# EAGLE design Exoskeleton_PCB_v2 (EAGLE 9.6.2)
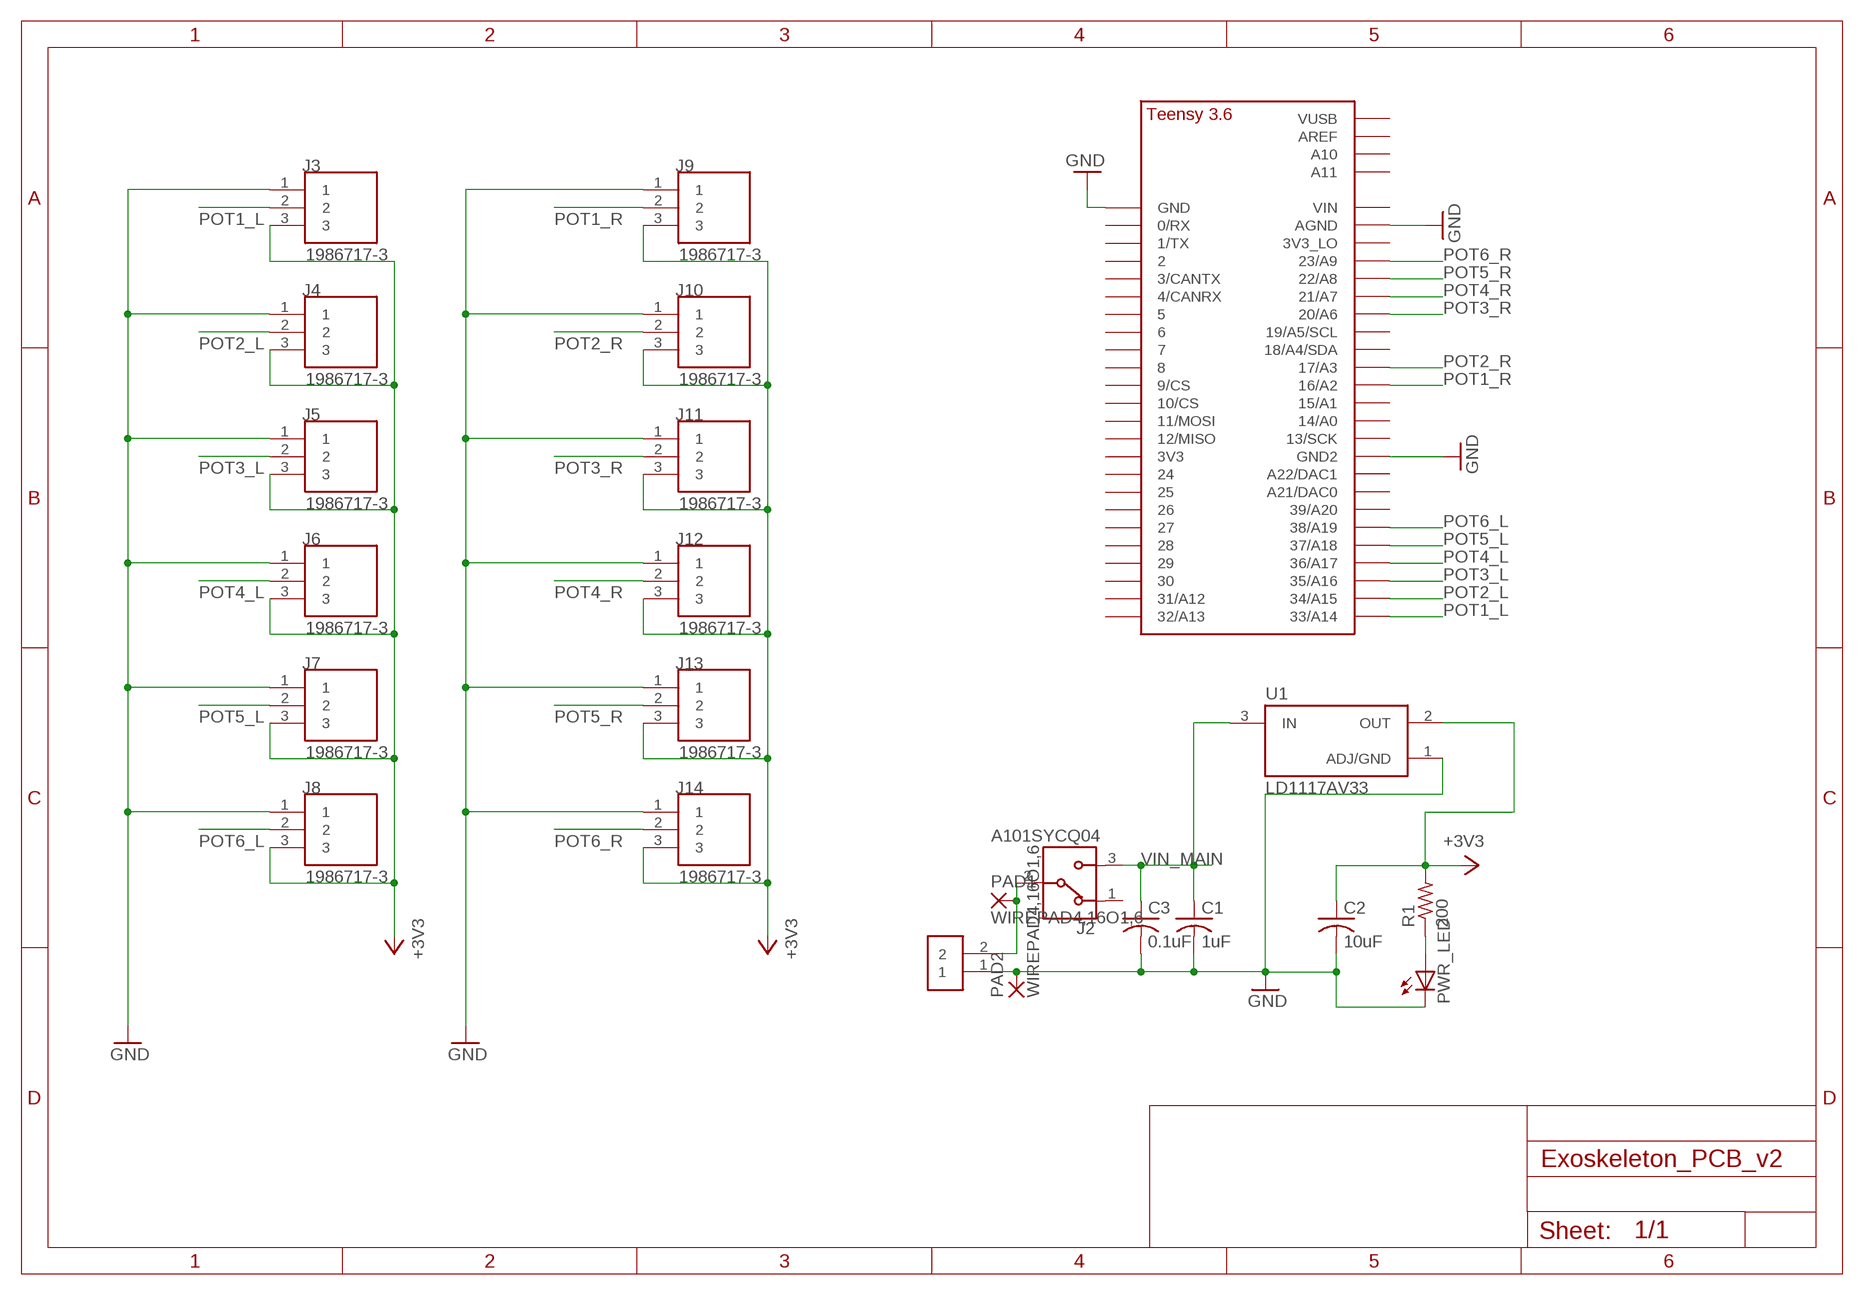
[diagram p0: schematic, sheet 1]

## Parts
C1  1uF  C-US050-030X075  [C050-030X075]
C2  10uF  C-US050-030X075  [C050-030X075]
C3  0.1uF  C-US050-030X075  [C050-030X075]
J1  282837-2  [TE_282837-2]
J2  A101SYCQ04  [TE_A101SYCQ04]
J3  1986717-3  [TE_1986717-3]
J4  1986717-3  [TE_1986717-3]
J5  1986717-3  [TE_1986717-3]
J6  1986717-3  [TE_1986717-3]
J7  1986717-3  [TE_1986717-3]
J8  1986717-3  [TE_1986717-3]
J9  1986717-3  [TE_1986717-3]
J10  1986717-3  [TE_1986717-3]
J11  1986717-3  [TE_1986717-3]
J12  1986717-3  [TE_1986717-3]
J13  1986717-3  [TE_1986717-3]
J14  1986717-3  [TE_1986717-3]
PAD1  WIREPAD4,16O1,6  [4,16O1,6]
PAD2  WIREPAD4,16O1,6  [4,16O1,6]
PWR_LED  LED5MM  [LED5MM]
R1  200  R-US_0207/9  [0207/9]
U1  LD1117AV33  [TO255P1020X450X1968-3]
U$1  TEENSY_3.5/3.6_BASIC  [TEENSY_3.5/3.6_BASIC]

## Nets
+3V3 [PWR]: C2.1 J3.3 J4.3 J5.3 J6.3 J7.3 J8.3 J9.3 J10.3 J11.3 J12.3 J13.3 J14.3 R1.2 U1.2(OUT)
GND: C1.2 C2.2 C3.2 J1.1 J3.1 J4.1 J5.1 J6.1 J7.1 J8.1 J9.1 J10.1 J11.1 J12.1 J13.1 J14.1 PAD2.1(P) PWR_LED.K(C) U1.1(ADJ/GND) U$1.AGND U$1.GND U$1.GND2
N$1: PWR_LED.A R1.1
N$8: J1.2 J2.2 PAD1.1(P)
POT1_L: J3.2 U$1.33/A14
POT1_R: J9.2 U$1.16/A2
POT2_L: J4.2 U$1.34/A15
POT2_R: J10.2 U$1.17/A3
POT3_L: J5.2 U$1.35/A16
POT3_R: J11.2 U$1.20/A6
POT4_L: J6.2 U$1.36/A17
POT4_R: J12.2 U$1.21/A7
POT5_L: J7.2 U$1.37/A18
POT5_R: J13.2 U$1.22/A8
POT6_L: J8.2 U$1.38/A19
POT6_R: J14.2 U$1.23/A9
VIN_MAIN: C1.1 C3.1 J2.3 U1.3(IN)
Unconnected: J2.1 U$1.0/RX U$1.1/TX U$1.2 U$1.3/CANTX U$1.3V3 U$1.3V3_LO U$1.4/CANRX U$1.5 U$1.6 U$1.7 U$1.8 U$1.9/CS U$1.10/CS U$1.11/MOSI U$1.12/MISO U$1.13/SCK U$1.14/A0 U$1.15/A1 U$1.18/A4/SDA U$1.19/A5/SCL U$1.21/DAC0(A21/DAC0) U$1.24 U$1.25 U$1.26 U$1.27 U$1.28 U$1.29 U$1.30 U$1.31/A12 U$1.32/A13 U$1.39/A20 U$1.A10 U$1.A11 U$1.A22/DAC1 U$1.AREF U$1.VIN U$1.VUSB

## Library data of the parts
C1-C3 = adafruit:C-US: CAPACITOR, American symbol
J1 = 282837-2:282837-2: TERM BLOCK 5.08MM 2POS SIDE ENTY; AVAILABILITY: Unavailable; COMMENT: 282837-2; DESCRIPTION: Connector Terminal Blocks Receptacle 2 Position 5.08mm Solder Straight Thru-Hole 13.5A/Contact; MF: TE Connectivity; MP: 282837-2; PACKAGE: None; PRICE: None; TE_PURCHASE_URL: https://www.te.com/usa-en/product-282837-2.html?te_bu=Cor&te_type=disp&te_campaign=seda_glo_cor-seda-global-disp-prtnr-fy19-seda-model-bom-cta_sma-317_1&elqCampaignId=32493
J2 = A101SYCQ04:A101SYCQ04: Switch Toggle ON None ON SPDT Long Baton Lever PC Pins 5A 250VAC 28VDC PC Mount with Threads Bulk Check prices <https://snapeda.com/parts/A101SYCQ04/TE%20Connectivity/view-part/?ref=eda>; AVAILABILITY: Warning; COMMENT: 4-1825136-5; DESCRIPTION: Toggle Switch SPDT Panel Mount; MF: TE Connectivity; MOUSER-PURCHASE-URL: https://snapeda.com/shop?store=Mouser&id=293772; MP: A101SYCQ04; PACKAGE: SOIC-8 TE Connectivity; PRICE: None
J3-J14 = 1986717-3:1986717-3: HEADER, 3P, 3.5mm 12.5 H Check prices <https://pricing.snapeda.com/parts/1986717-3/TE%20Connectivity/view-part?ref=eda>; AVAILABILITY: Good; CENTERLINE_PITCH: 3.5 mm[.138 in]; COMMENT: 1986717-3; DESCRIPTION: 3 Position Terminal Block Header, Male Pins, Unshrouded 0.138 (3.50mm) Vertical Through Hole; MF: TE Connectivity; MP: 1986717-3; NUMBER_OF_POSITIONS: 3; PACKAGE: None; PRICE: None; PURCHASE-URL: https://pricing.snapeda.com/search/part/1986717-3/?ref=eda
PAD1 PAD2 = wirepad:WIREPAD: Wire PAD connect wire on PCB
PWR_LED = adafruit:LED: LED OSRAM: - CHIPLED LG R971, LG N971, LY N971, LG Q971, LY Q971, LO R971, LY R971 LH N974, LH R974 LS Q976, LO Q976, LY Q976 LO Q996 - Hyper CHIPLED LW Q18S LB Q993, LB Q99A, LB R99A - SideLED LS A670, LO A670, LY A670, LG A670, LP A670 LB A673, LV A673, LT A673, LW A673 LH A674 LY A675 LS A676, LA A676, LO A676, LY A676, LW A676 LS A679, LY A679, LG A679 - Hyper Micro SIDELED® LS Y876, LA Y876, LO Y876, LY Y876 LT Y87S - SmartLED LW L88C, LW L88S LB L89C, LB L89S, LG L890 LS L89K, LO L89K, LY L89K LS L896, LA L896, LO L896, LY L896 - TOPLED LS T670, LO T670, LY T670, LG T670, LP T670 LSG T670, LSP T670, LSY T670, LOP T670, LYG T670 LG T671, LOG T671, LSG T671 LB T673, LV T673, LT T673, LW T673 LH T674 LS T676, LA T676, LO T676, LY T676, LB T676, LH T676, LSB T676, LW T676 LB T67C, LV T67C, LT T67C, LS T67K, LO T67K, LY T67K, LW E67C LS E67B, LA E67B, LO E67B, LY E67B, LB E67C, LV E67C, LT E67C LW T67C LS T679, LY T679, LG T679 LS T770, LO T770, LY T770, LG T770, LP T770 LB T773, LV T773, LT T773, LW T773 LH T774 LS E675, LA E675, LY E675, LS T675 LS T776, LA T776, LO T776, LY T776, LB T776 LHGB T686 LT T68C, LB T68C - Hyper Mini TOPLED® LB M676 - Mini TOPLED Santana® LG M470 LS M47K, LO M47K, LY M47K Source: http://www.osram.convergy.de/
R1 = adafruit:R-US_: RESISTOR, American symbol
U1 = LD1117AV33:LD1117AV33: Linear Voltage Regulator IC 1 Output 1A TO-220AB Check prices <https://pricing.snapeda.com/parts/LD1117AV33/STMicroelectronics/view-part?ref=eda>; AVAILABILITY: Good; DESCRIPTION: Linear Voltage Regulator IC 1 Output 1A TO-220AB; MF: STMicroelectronics; MP: LD1117AV33; PACKAGE: TO-220 STMicroelectronics; PRICE: None; PURCHASE-URL: https://pricing.snapeda.com/search/part/LD1117AV33/?ref=eda
U$1 = Teensy356:TEENSY_3.5/3.6_BASIC

## Net classes
0 default: width 0.254 mm
1 PWR: width 1.27 mm, clearance 0.254 mm

## Board
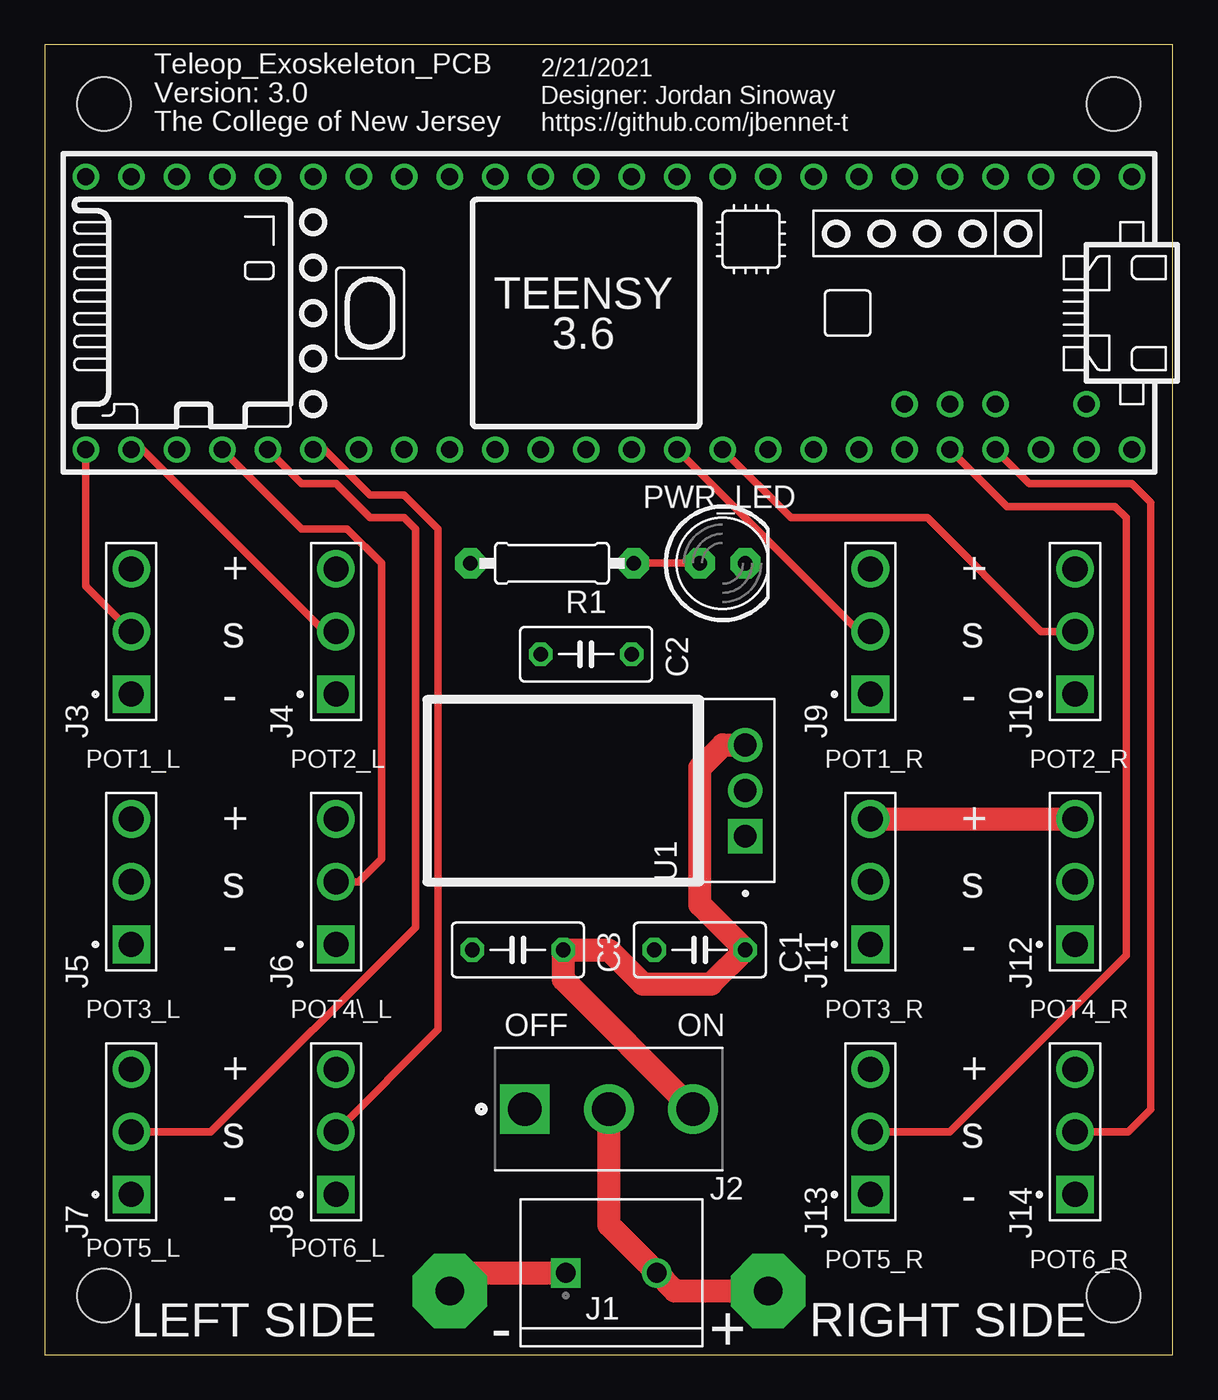
[diagram p1: board, top side]
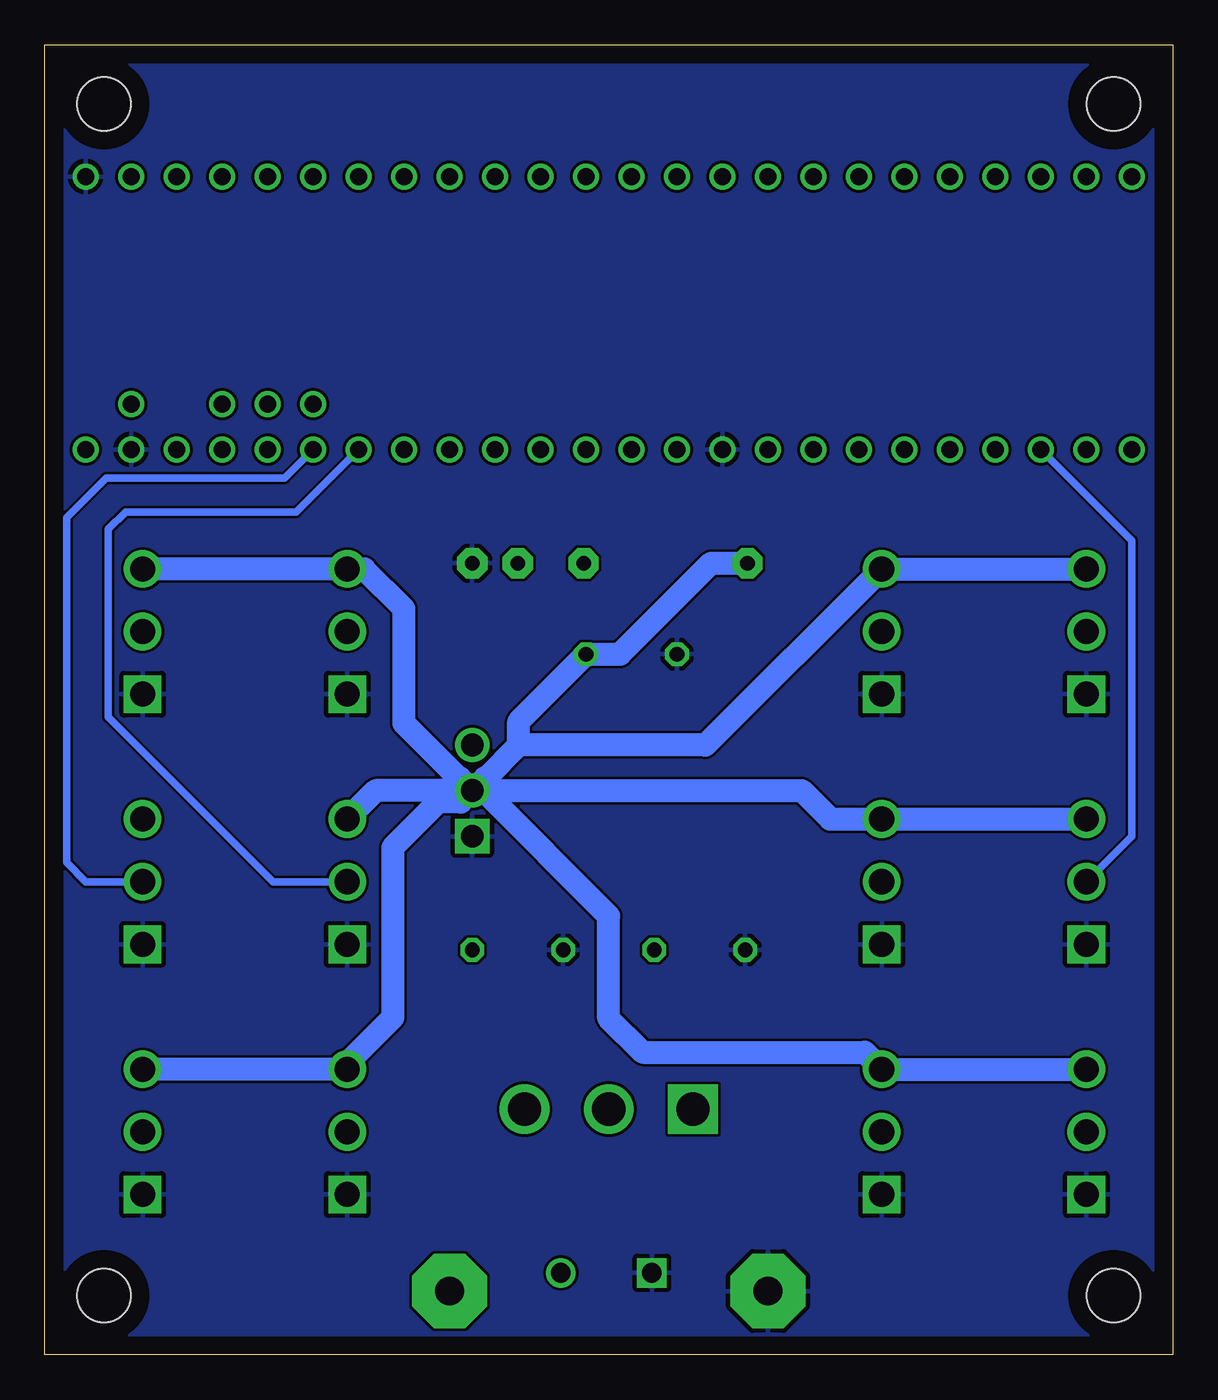
[diagram p2: board, bottom side, seen from below]

Size 63 x 73.15 mm. Coordinates in mm from the lower left corner, seen from the top.
Outline: 63,73.15 0,73.15 0,0 63,0 63,73.15
Copper layers (1*16): Top 0.035mm / dielectric 1.5mm / Bottom 0.035mm
Design rules "default": minimum track width 6mil, minimum drill 0.35mm, track to track 6mil, track to pad 6mil, pad to pad 6mil, via to via 6mil, smd to smd 6mil, copper to edge 40mil, drill to drill 6mil, minimum pad ring 10mil, minimum via ring 8mil, stop-mask expansion 4mil, vias tented up to drill 0mil, thermal gap 10mil
Holes 3 mm at 3.31,3.3 59.7,3.3 59.7,69.85 3.31,69.85

### Footprints (pad centres in the part's own frame; a part is rotated, then mirrored left to right if it is on the bottom)
C050-030X075 = drill 0.813 octagon: 1 -2.54,0; 2 2.54,0
TE_282837-2 = drill 1.1 square: 1 -2.54,0 | drill 1.1: 2 2.54,0
TE_A101SYCQ04 = drill 1.854 square: 1 -4.699,0 | drill 1.854: 2 0,0; 3 4.699,0
TE_1986717-3 = drill 1.4 square: 1 -3.5,0 | drill 1.4: 2 0,0; 3 3.5,0
4,16O1,6 = drill 1.6 pad 4.166 octagon: 1 0,0
LED5MM = drill 0.813 pad 1.676 octagon: A -1.27,0; K 1.27,0
0207/9 = drill 0.813 pad 1.676 octagon: 1 -4.572,0; 2 4.572,0
TO255P1020X450X1968-3 = drill 1.27 pad 1.91 square: 1 0,0 | drill 1.27 pad 1.91: 2 2.55,0; 3 5.1,0
TEENSY_3.5/3.6_BASIC = drill 0.965: 0/RX -25.4,-7.62; 1/TX -22.86,-7.62; 2 -20.32,-7.62; 3/CANTX -17.78,-7.62; 3V3 7.62,-7.62; 3V3_LO -22.86,7.62; 4/CANRX -15.24,-7.62; 5 -12.7,-7.62; 6 -10.16,-7.62; 7 -7.62,-7.62; 8 -5.08,-7.62; 9/CS -2.54,-7.62; 10/CS 0,-7.62; 11/MOSI 2.54,-7.62; 12/MISO 5.08,-7.62; 13/SCK 5.08,7.62; 14/A0 2.54,7.62; 15/A1 0,7.62; 16/A2 -2.54,7.62; 17/A3 -5.08,7.62; 18/A4/SDA -7.62,7.62; 19/A5/SCL -10.16,7.62; 20/A6 -12.7,7.62; 21/A7 -15.24,7.62; 21/DAC0 12.7,7.62; 22/A8 -17.78,7.62; 23/A9 -20.32,7.62; 24 10.16,-7.62; 25 12.7,-7.62; 26 15.24,-7.62; 27 17.78,-7.62; 28 20.32,-7.62; 29 22.86,-7.62; 30 25.4,-7.62; 31/A12 27.94,-7.62; 32/A13 30.48,-7.62; 33/A14 30.48,7.62; 34/A15 27.94,7.62; 35/A16 25.4,7.62; 36/A17 22.86,7.62; 37/A18 20.32,7.62; 38/A19 17.78,7.62; 39/A20 15.24,7.62; A10 -17.78,5.08; A11 -15.24,5.08; A22/DAC1 10.16,7.62; AGND -25.4,7.62; AREF -20.32,5.08; GND -27.94,-7.62; GND2 7.62,7.62; VIN -27.94,7.62; VUSB -25.4,5.08

### Placement (x,y rotation side)
C1  36.58,22.61 180 top
C2  30.23,39.12 180 top
C3  26.42,22.61 180 top
J1  31.64,4.57 0 top
J2  31.5,13.72 0 top
J3  4.83,40.39 90 top
J4  16.26,40.39 90 top
J5  4.83,26.42 90 top
J6  16.26,26.42 90 top
J7  4.83,12.45 90 top
J8  16.26,12.45 90 top
J9  46.11,40.39 90 top
J10  57.54,40.39 90 top
J11  46.11,26.42 90 top
J12  57.54,26.42 90 top
J13  46.11,12.45 90 top
J14  57.54,12.45 90 top
PAD1  40.39,3.56 0 top
PAD2  22.61,3.56 0 top
PWR_LED  37.85,44.2 0 top
R1  28.33,44.2 180 top
U1  39.12,28.96 90 top
U$1  32.77,58.17 180 top

### Tracks (layer width: path | path; a pad name or v marks a point on that pad's centre or on a via)
+3V3
  Top 1.27: J11.3 J12.3
  Bottom 1.27: J11.3 44.52,31.51 U1.2 | J14.3 J13.3 46.43,15.95 43.57,18.81 43.57,28.32 41.03,30.86 39.77,30.86 U1.2 | J5.3 J6.3 19.13,29.92 20.72,31.51 U1.2 | J3.3 J4.3 26.11,34.04 36.53,34.04 | R1.2 25.79,44.2 30.87,39.12 C2.1 36.53,35.35 36.53,34.04 | J7.3 J8.3 17.21,16.89 29.6,16.89 31.5,18.8 31.5,24.5 38.5,31.51 U1.2 | U1.2 38.42,32.21 38.36,32.21 36.53,34.04 | U1.2 39.83,32.21 39.89,32.21 42.93,35.26 42.93,41.66 45.16,43.89 J9.3 J10.3
GND
  Top 1.27: PAD2.1 23.63,4.57 J1.1
  pour Bottom: 1.02,72.14 61.98,72.14 61.98,1.02 1.02,1.02
N$1
  Top 0.406: R1.1 PWR_LED.A
N$8
  Top 1.27: PAD1.1 35.19,3.56 J1.2 31.5,7.25 J2.2
POT1_L
  Top 0.406: U$1.33/A14 2.29,42.93 J3.2
POT1_R
  Top 0.406: U$1.16/A2 45.47,40.39 J9.2
POT2_L
  Top 0.406: J4.2 15.63,40.39 5.47,50.55 U$1.34/A15
POT2_R
  Top 0.406: U$1.17/A3 41.66,46.74 49.28,46.74 55.63,40.39 J10.2
POT3_L
  Bottom 0.406: U$1.35/A16 2.29,45.47 2.29,28.96 J5.2
POT3_R
  Bottom 0.406: U$1.20/A6 48.96,47.05 58.49,47.05 59.44,46.1 59.44,35.62 50.23,26.42 J11.2
POT4_L
  Top 0.406: J6.2 17.53,26.42 18.8,27.69 18.8,44.2 16.9,46.1 14.36,46.1 U$1.36/A17
POT4_R
  Bottom 0.406: U$1.21/A7 49.6,48.96 59.56,48.96 61.78,46.74 61.78,27.48 60.71,26.42 J12.2
POT5_L
  Top 0.406: J7.2 9.28,12.45 20.71,23.88 20.71,46.1 20.07,46.74 18.17,46.74 16.26,48.64 14.36,48.64 U$1.37/A18
POT5_R
  Top 0.406: U$1.22/A8 53.73,47.37 59.76,47.37 60.39,46.74 60.39,22.29 50.55,12.45 J13.2
POT6_L
  Top 0.406: U$1.38/A19 15.63,50.55 18.17,48.01 20.07,48.01 21.98,46.1 21.98,18.16 J8.2
POT6_R
  Top 0.406: U$1.23/A9 55,48.64 60.71,48.64 61.78,47.57 61.78,13.72 60.51,12.45 J14.2
VIN_MAIN
  Top 1.27: U1.3 37.87,34.06 36.58,32.77 36.58,25.15 C1.1 37.22,20.7 33.41,20.7 31.5,22.61 C3.1 28.96,20.96 J2.3

### Text on the board
tPlace: Teleop_Exoskeleton_PCB / Version: 3.0 / The College of New Jersey | 2/21/2021 / Designer: Jordan Sinoway / https://github.com/jbennet-t | OFF | ON | LEFT SIDE | - | + | RIGHT SIDE
tNames: + / s / - | + / s / - | POT1_L | POT2_L | POT1_R | POT2_R | + / s / - | + / s / - | POT3_L | POT4\_L | POT3_R | POT4_R | + / s / - | + / s / - | POT5_L | POT6_L | POT5_R | POT6_R